# EAGLE schematic PCB_v1 (EAGLE 7.4.0)
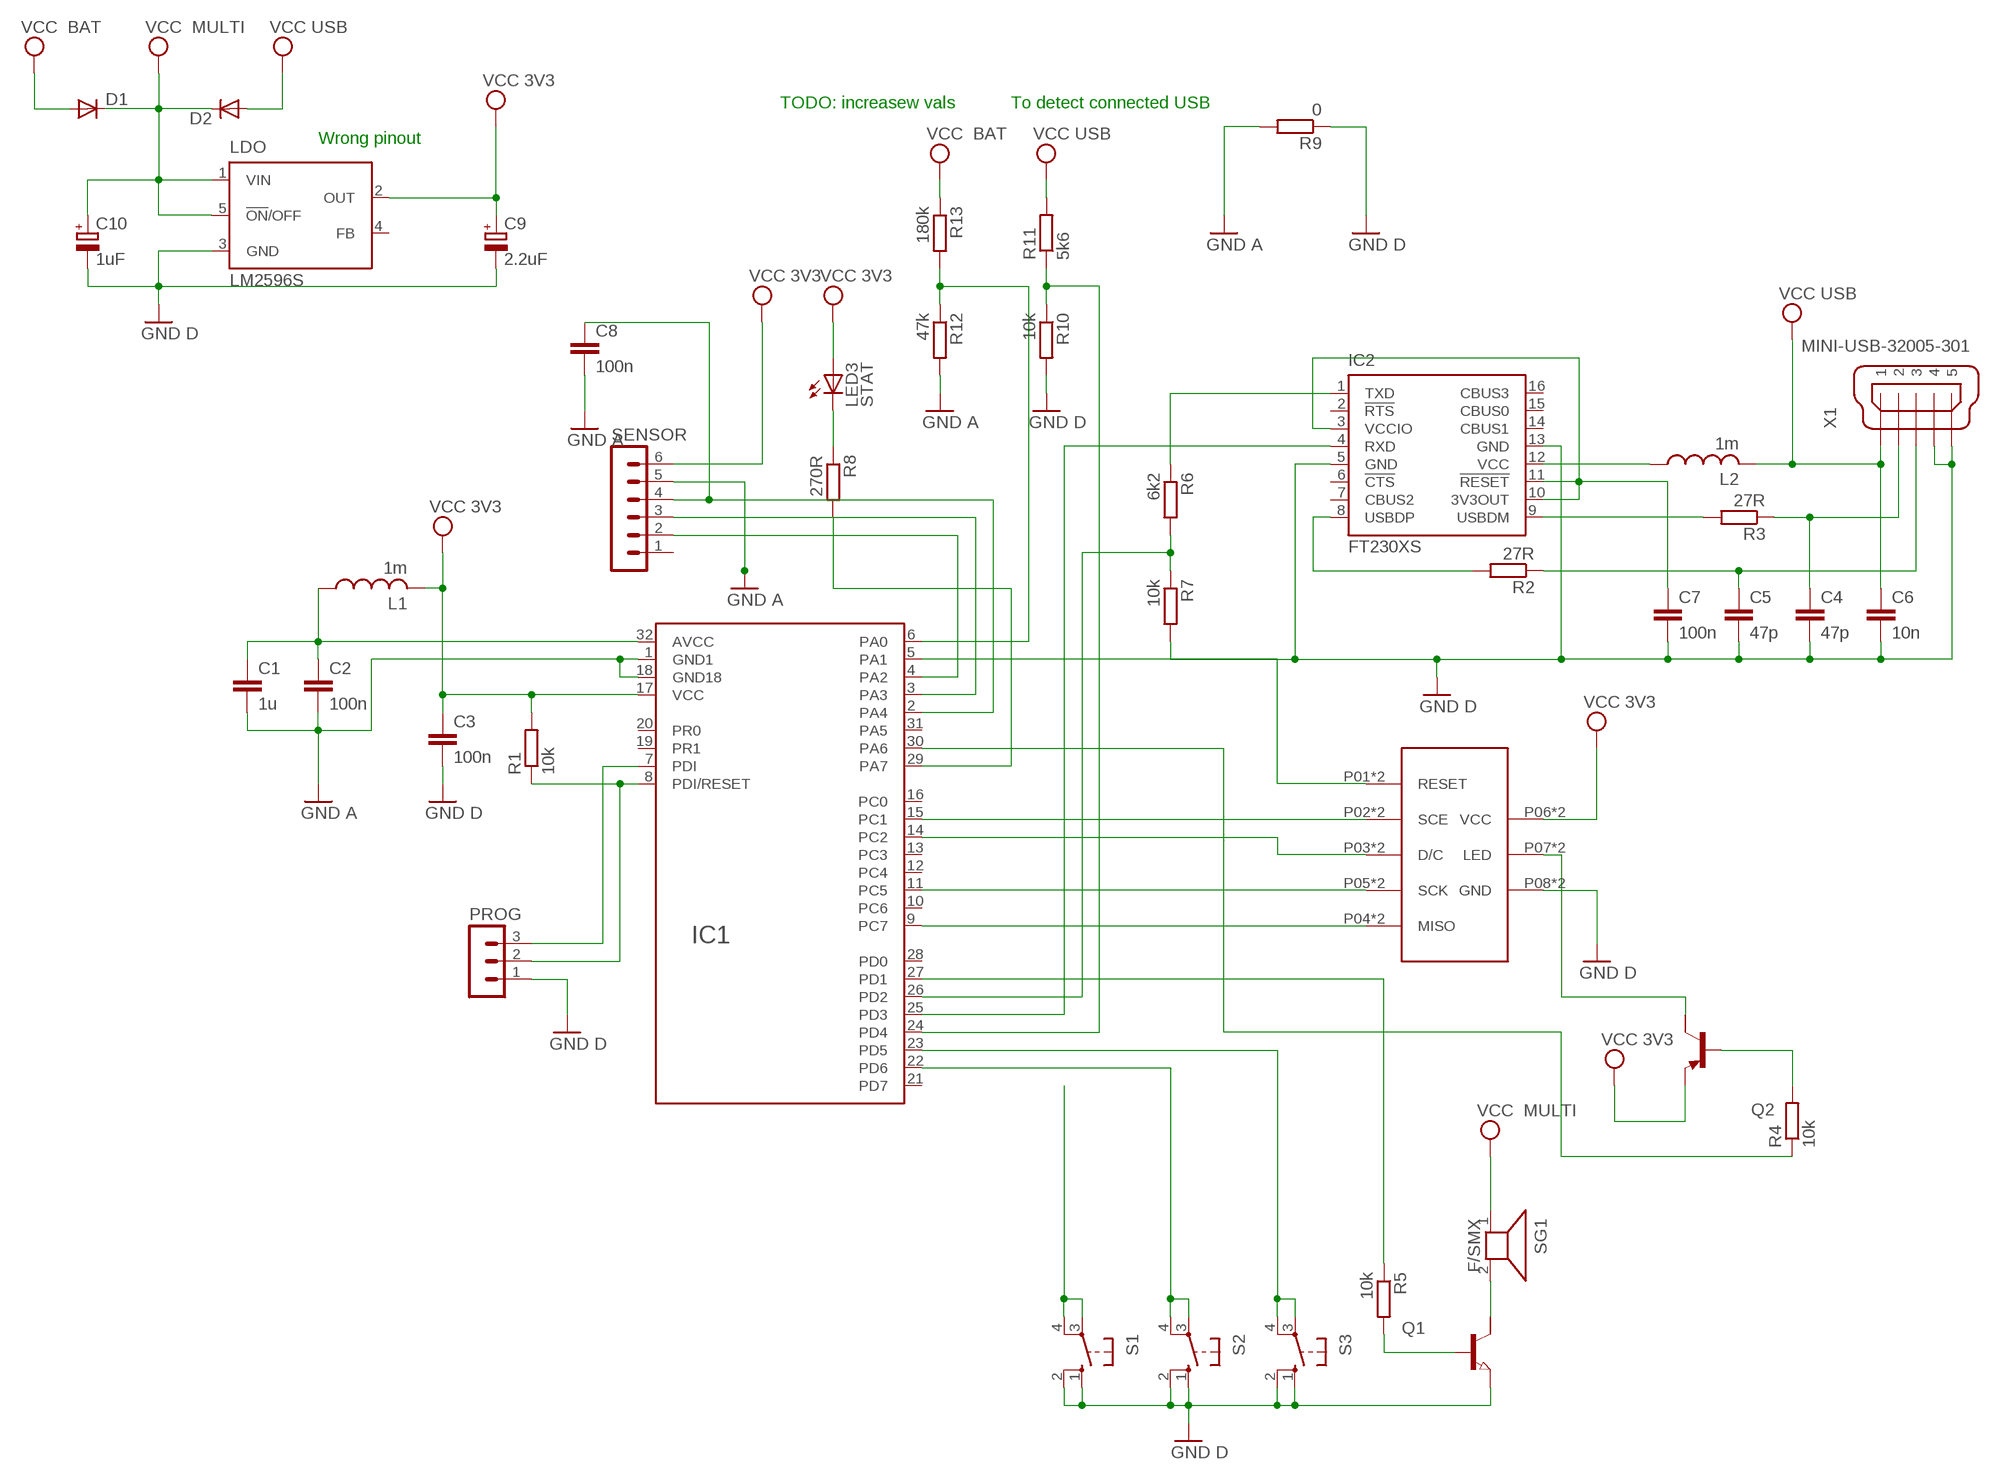
[diagram p0: schematic, sheet 1]

## Parts
3310  3310  [3310]
C1  1u  C  [C0805]
C2  100n  C  [C0805]
C3  100n  C  [C0805]
C4  47p  C  [C0805]
C5  47p  C  [C0805]
C6  10n  C  [C0805]
C7  100n  C  [C0805]
C8  100n  C  [C0805]
C9  2.2uF  CPOL-EU085CS-1AW  [085CS_1AW]
C10  1uF  CPOL-EU085CS-1AW  [085CS_1AW]
D1  1N4148DO35-7  [DO35-7]
D2  1N4148DO35-7  [DO35-7]
IC1  ATXMEGA32E5/16E5/8E5ATXMEGA32E5-AU  [TQFP32-08]
IC2  FT230XS  [SSOP16]
L1  1m  L-USL2012C  [L2012C]
L2  1m  L-USL2012C  [L2012C]
LDO  LM2596S  [TO263-5]
LED3  STAT  LED_E  [LED_1206]
PROG  MA03-1  [MA03-1]
Q1  NPN-TRANSISTIOR-2COLSOT143  [SOT143]
Q2  PNP-TRANSISTIOR-2COLSOT89  [SOT89]
R1  10k  RR3216  [R3216]
R2  27R  RR3216  [R3216]
R3  27R  RR3216  [R3216]
R4  10k  RR3216  [R3216]
R5  10k  RR3216  [R3216]
R6  6k2  RR3216  [R3216]
R7  10k  RR3216  [R3216]
R8  270R  RR3216  [R3216]
R9  0  RR3216  [R3216]
R10  10k  RR3216  [R3216]
R11  5k6  RR3216  [R3216]
R12  47k  RR3216  [R3216]
R13  180k  RR3216  [R3216]
S1  40-XX  [B3F-40XX]
S2  40-XX  [B3F-40XX]
S3  40-XX  [B3F-40XX]
SENSOR  MA06-1  [MA06-1]
SG1  F/SMX  [F/SMX]
X1  MINI-USB-32005-301  [32005-301]

## Nets
GND: 3310.P08(GND) 3310.P18(GND) C1.2 C2.2 C3.2 C4.2 C5.2 C6.2 C7.2 C8.2 C9.- C10.- IC1.1(GND1) IC1.18(GND18) IC2.5(GND) IC2.13(GND) LDO.3(GND) PROG.1 Q1.3(E) R7.2 R9.2 R10.2 R12.2 S1.1(S) S1.2(S1) S2.1(S) S2.2(S1) S3.1(S) S3.2(S1) SENSOR.5 X1.4 X1.5 ; supply symbol labelled GND D, GND A
N$1: 3310.P02(SCE) 3310.P12(SCE)
N$3: 3310.P03(D/C) 3310.P13(D/C) IC1.14(PC2)
N$4: 3310.P05(SCK) 3310.P15(SCK) IC1.11(PC5)
N$5: 3310.P04(MISO) 3310.P14(MISO) IC1.9(PC7)
N$6: C1.1 C2.1 IC1.32(AVCC) L1.1
N$7: IC1.23(PD5) S3.3(P) S3.4(P1)
N$8: IC2.12(VCC) L2.1
N$9: C4.1 R3.1 X1.2
N$10: C5.1 R2.1 X1.3
N$11: IC1.7(PDI) PROG.3
N$12: IC1.8(PDI/RESET) PROG.2 R1.1
N$13: IC2.8(USBDP) R2.2
N$14: IC2.9(USBDM) R3.2
N$15: 3310.P01(RESET) 3310.P11(RESET) IC1.5(PA1)
N$16: C7.1 IC2.3(VCCIO) IC2.10(3V3OUT) IC2.11(!RESET)
N$17: IC2.1(TXD) R6.1
N$18: IC1.26(PD2) R6.2 R7.1
N$19: IC1.25(PD3) IC2.4(RXD)
N$20: IC1.4(PA2) SENSOR.2
N$21: IC1.3(PA3) SENSOR.3
N$22: C8.1 IC1.2(PA4) SENSOR.4
N$24: IC1.22(PD6) S2.3(P) S2.4(P1)
N$25: S1.3(P) S1.4(P1)
N$26: LED3.C R8.1
N$27: 3310.P07(LED) 3310.P17(LED) Q2.2(C)
N$28: Q1.2(C) SG1.2
N$30: Q1.1(B) R5.2
N$31: Q2.1(B) R4.2
N$39: IC1.6(PA0) R12.1 R13.2
N$40: IC1.30(PA6) R4.1
N$41: IC1.27(PD1) R5.1
N$42: IC1.29(PA7) R8.2
N$44: IC1.24(PD4) R10.1 R11.1
R9: R9.1 ; supply symbol labelled GND D
VCC: 3310.P06(VCC) 3310.P16(VCC) C3.1 C6.1 C9.+ C10.+ D1.A D1.C D2.A D2.C IC1.17(VCC) L1.2 L2.2 LDO.1(VIN) LDO.2(OUT) LDO.5(!ON!/OFF) LED3.A Q2.3(E) R1.2 R11.2 R13.1 SENSOR.6 SG1.1 X1.1 ; supply symbol labelled VCC 3V3, VCC USB, VCC MULTI, VCC BAT
Unconnected: IC1.10(PC6) IC1.12(PC4) IC1.13(PC3) IC1.15(PC1) IC1.16(PC0) IC1.19(PR1) IC1.20(PR0) IC1.21(PD7) IC1.28(PD0) IC1.31(PA5) IC2.2(!RTS) IC2.6(!CTS) IC2.7(CBUS2) IC2.14(CBUS1) IC2.15(CBUS0) IC2.16(CBUS3) LDO.4(FB) Q1.4(C/) Q2.2@1(C/) SENSOR.1

## Notes on the sheet
- TODO: increasew vals | To detect connected USB
- Wrong pinout

## Library data of the parts
3310 = 3310LCD:3310: 3310 LCD
C1-C8 = eagle-ltspice:C: CAPACITOR, European symbol; SPICEMODEL: NONE; SPICEPREFIX: C
C9 C10 = resistor:CPOL-EU: POLARIZED CAPACITOR, European symbol
D1 D2 = diode:1N4148: DIODE high speed (Philips)
IC1 = atmega-atxmega:ATXMEGA32E5/16E5/8E5: 8/16-bit Atmel AVR XMEGA Microcontrollers
IC2 = ftdichip:FT230X: USB to BASIC UART IC Auto generated by make-symbol-device-package-bsdl.ulp Rev. 43 Source: Data sheet <http://www.ftdichip.com/Support/Documents/DataSheets/ICs/DS_FT230X.pdf>
L1 L2 = rcl:L-US: INDUCTOR, American symbol
LDO = national-semiconductor:LM2596: SIMPLE SWITCHER® Power Converter 150 kHz 3A Step-Down Voltage Regulator Source: http://www.national.com/ds/LM/LM2596.pdf; MF: NATIONAL SEMICONDUCTOR; MPN: LM2596S-ADJ/NOPB; OC_FARNELL: 9494367; OC_NEWARK: 41K3842
LED3 = eagle-ltspice:LED_E: LED Source: http://www.osram.convergy.de Source: www.luxeon.com Source: www.kingbright.com; SPICEMODEL: NONE; SPICEPREFIX: D; SPICETYPE: diode
PROG = con-lstb:MA03-1: PIN HEADER; OC_FARNELL: unknown; OC_NEWARK: unknown
Q1 = semicon-smd-ipc:NPN-TRANSISTIOR-2COL: NPN TRANSISTOR 2 colletor pins
Q2 = semicon-smd-ipc:PNP-TRANSISTIOR-2COL: PNP TRANSISTOR 2 colletor pins
R1-R13 = eagle-ltspice:R: RESISTOR, European symbol; SPICEMODEL: NONE; SPICEPREFIX: R
S1-S3 = switch-omron:40-XX: OMRON SWITCH; MF: OMRON COMPONENTS USA; MPN: B3F-4000; OC_FARNELL: 176434; OC_NEWARK: 36K3105
SENSOR = con-lstb:MA06-1: PIN HEADER; OC_FARNELL: unknown; OC_NEWARK: unknown
SG1 = buzzer:F/SMX: BUZZER Source: Buerklin; OC_FARNELL: unknown; OC_NEWARK: unknown
X1 = con-cypressindustries:MINI-USB-: MINI USB-B Conector Source: www.cypressindustries.com; OC_FARNELL: unknown; OC_NEWARK: unknown